# EasyEDA Pro project LY-5X-V3.1 - (0826)留EN.eprj, board 4轴PCB
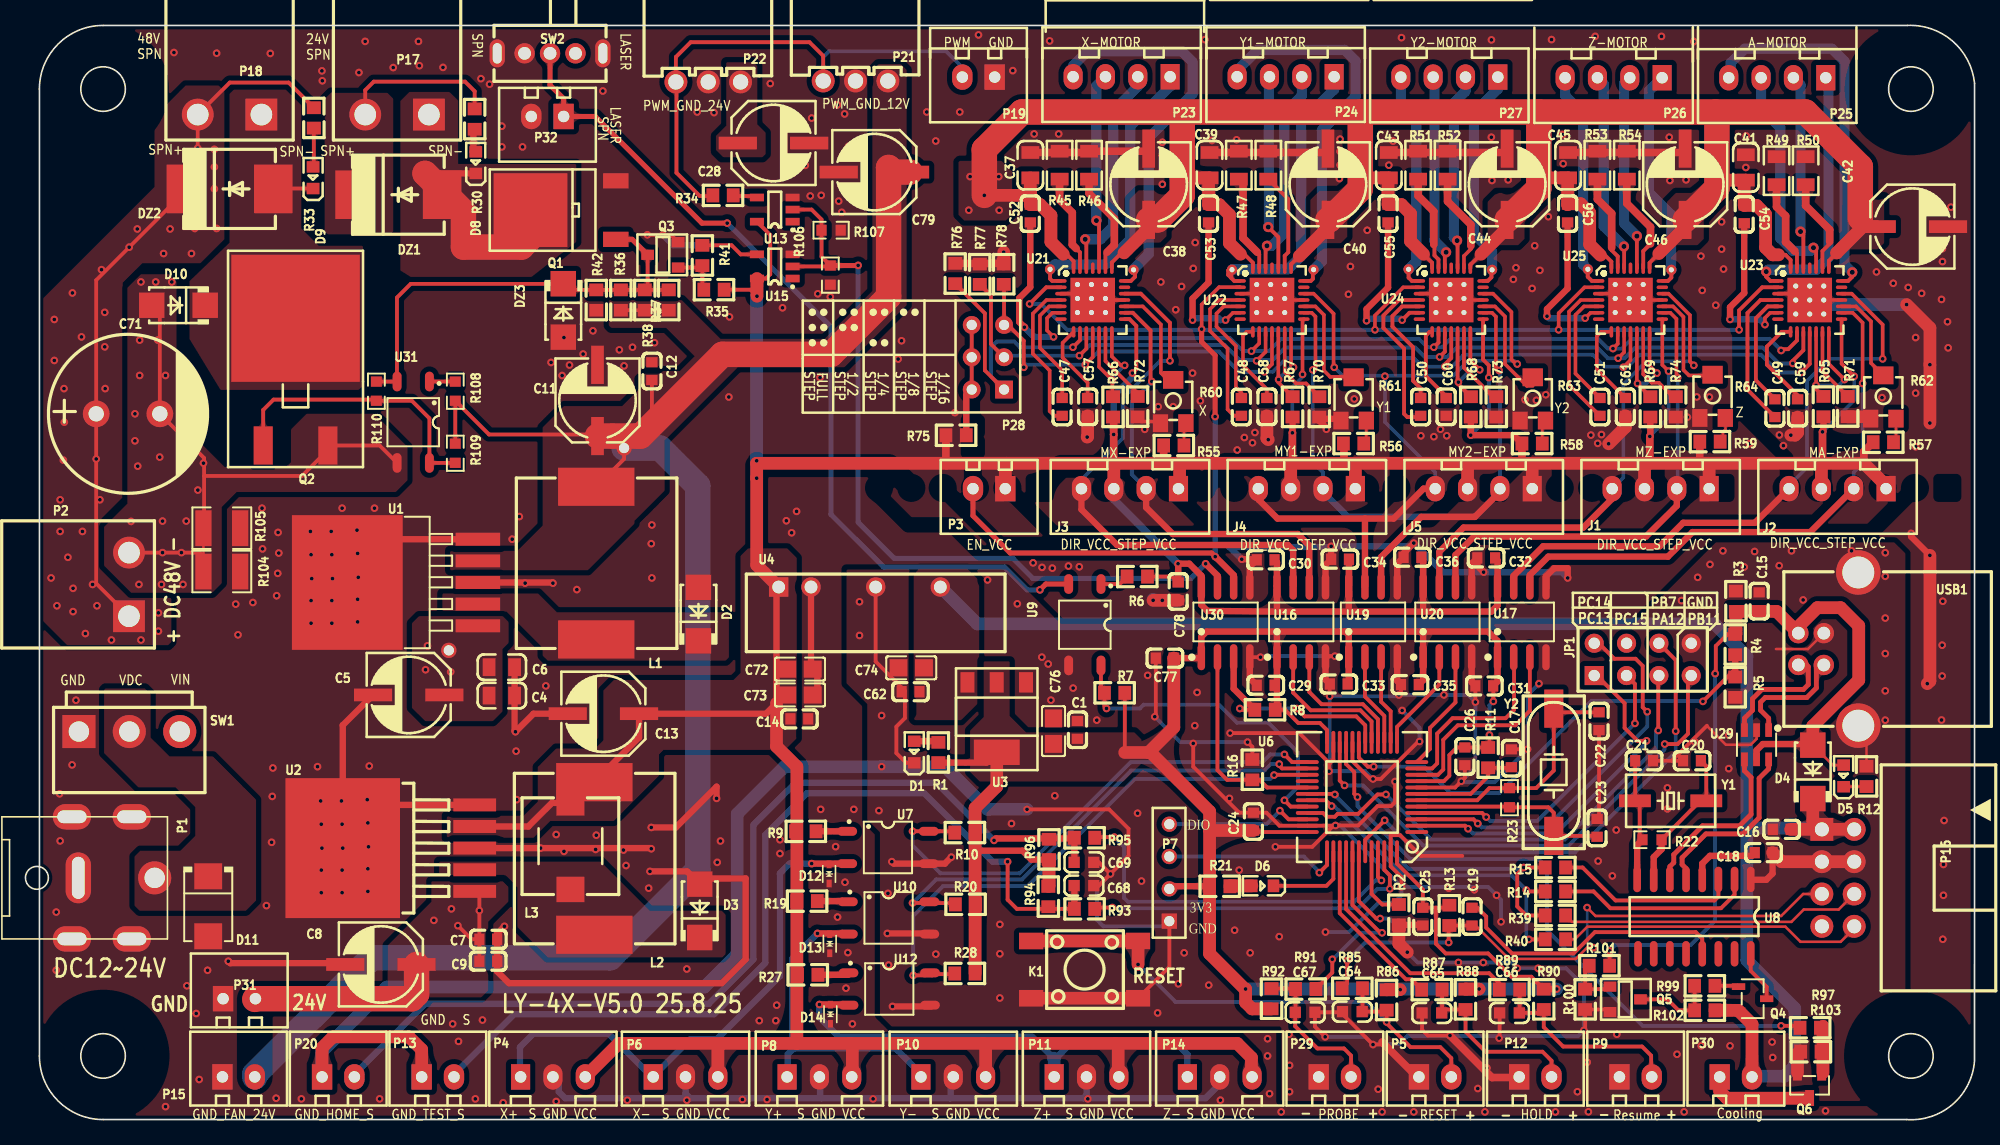
[diagram p1: board, top side]
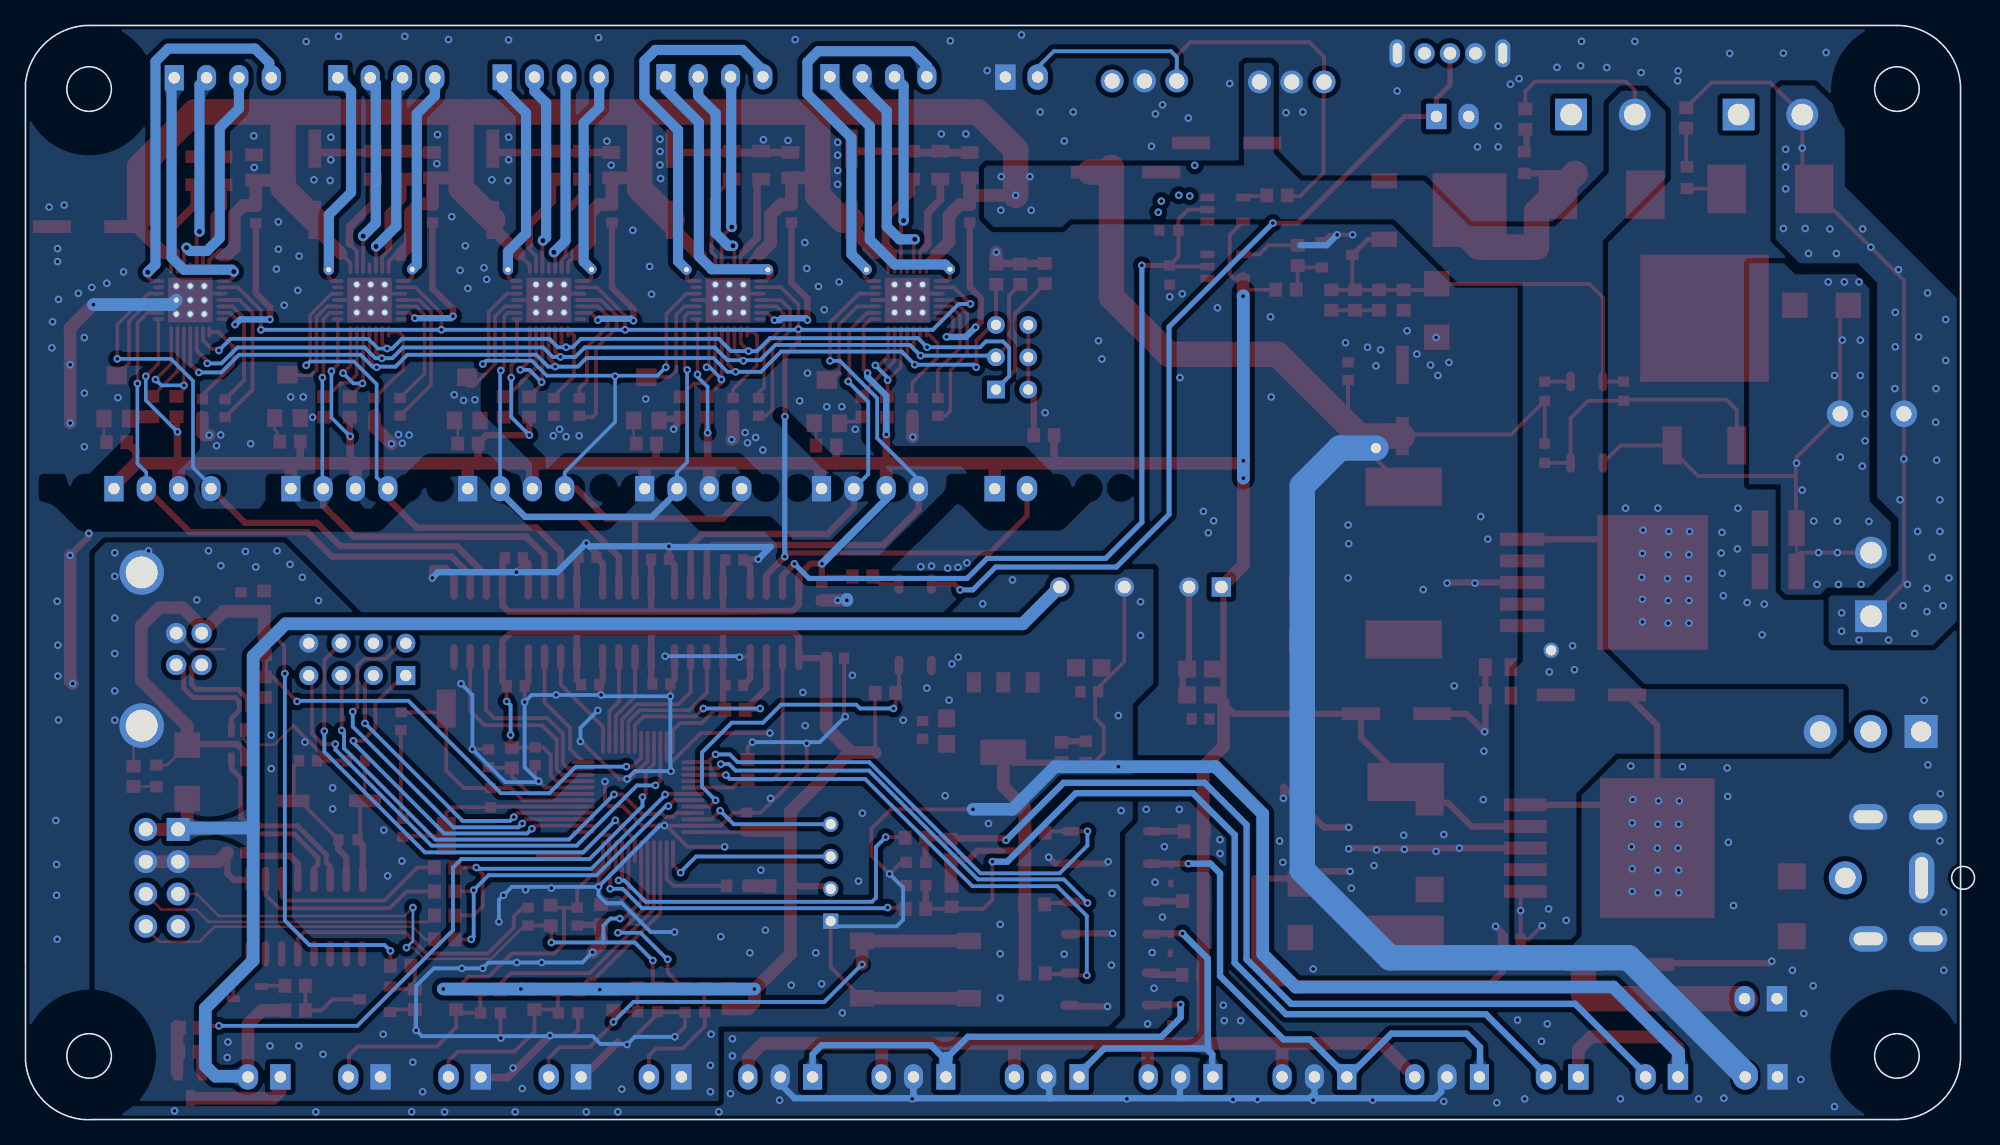
[diagram p2: board, bottom side, seen from below]

Outline 153.09 x 86 mm; copper layers: Top Layer, Bottom Layer. Coordinates in mm from the lower left corner of the outline.
Outline path: circle c6.1,81 r1.75 ; circle c6.1,5 r1.75 ; circle c148.1,81 r1.75 ; circle c148.1,5 r1.75 ; 1.1,81 1.1,5 arc(2.56,1.46) 6.1,0 147.76,0 arc(151.38,1.2) 153.09,4.62 153.09,81.43 arc(151.36,84.77) 147.81,86 6.1,86 arc(2.56,84.54) 1.1,81
Stack: Top Layer 0.0356mm / Dielectric1 0.32mm FR-4 er 4.8 / Bottom Layer 0.0356mm

## Design rules (mm)
net USB_DP: DP
net USB_DM: DP
net USB_DP_1: USB
net USB_DM_1: USB
template: 用户自定义配置
spacing Clearance (default): track to track 0.178, other pairs 0 to 0.3
track width Width (default): min 0.01, default 0.254, max 5.001
differential pair DiffPairsRouting (default): width min 0.381, default 0.381, max 0.381; gap min 0.254, default 0.254
via RoutingVias (default): diameter min 0.5, default 0.6, max 1.27; hole min 0.3, default 0.3, max 1

## Placement (name value [footprint] x y rotation side)
C1  104  [C0603]  82.63 30.63 270 top
C4  105  [0805C]  37.42 33.33 0 top
C5  100uF/35V  [电解电容贴片6x6]  30.1 33.38 180 top
C6  105  [0805C]  37.42 35.56 180 top
C7  105  [C0603]  36.35 12.45 0 top
C8  100uF/35V  [电解电容贴片6x6]  27.92 12.19 180 top
C9  105  [C0603]  36.35 14.17 180 top
C11  100uF/35V  [电解电容贴片6x6]  44.93 56.52 90 top
C12  104  [C0603]  49.2 58.83 270 top
C13  100uF/35V  [电解电容贴片6x6]  45.39 31.9 180 top
C14  104  [C0603]  60.79 31.5 180 top
C15  104  [C0603]  136.17 40.74 270 top
C16  104  [C0603]  137.95 22.81 0 top
C17  104  [C0603]  116.72 28.4 270 top
C18  103  [C0603]  136.53 20.98 0 top
C19  104  [C0603]  113.62 15.95 270 top
C20  18pF  [C0603]  130.9 28.2 180 top
C21  18pF  [C0603]  127.14 28.2 0 top
C22  100pF  [C0603]  123.6 31.31 270 top
C23  100pF  [C0603]  123.45 22.93 90 top
C24  104  [C0603]  96.45 23.42 270 top
C25  104  [C0603]  109.76 15.95 90 top
C26  104  [C0603]  113.06 28.55 90 top
C28  100uF/35V  [电解电容贴片6x6]  58.75 76.76 0 top
C29  100nF  [C0603]  97.41 34.14 180 top
C30  100nF  [C0603]  97.41 43.99 0 top
C31  100nF  [C0603]  114.58 34.09 180 top
C32  100nF  [C0603]  114.74 44.14 0 top
C33  100nF  [C0603]  103.15 34.24 180 top
C34  100nF  [C0603]  103.26 44.04 0 top
C35  100nF  [C0603]  108.74 34.19 180 top
C36  100nF  [C0603]  108.95 44.2 0 top
C37  105  [0805C]  78.93 75.02 90 top
C38  47uF/50V  [电解电容贴片6x6]  88.22 73.52 90 top
C39  105  [0805C]  93.01 75.02 90 top
C40  47uF/50V  [电解电容贴片6x6]  102.3 73.52 90 top
C41  105  [0805C]  135.13 74.84 90 top
C42  47uF/50V  [电解电容贴片6x6]  148.21 70.19 0 top
C43  105  [0805C]  107.09 75.02 90 top
C44  47uF/50V  [电解电容贴片6x6]  116.38 73.52 90 top
C45  105  [0805C]  121.17 75.02 90 top
C46  47uF/50V  [电解电容贴片6x6]  130.36 73.52 90 top
C47  104  [C0603]  81.43 56.02 90 top
C48  104  [C0603]  95.51 56.02 90 top
C49  104  [C0603]  137.42 55.91 90 top
C50  104  [C0603]  109.59 56.02 90 top
C51  104  [C0603]  123.67 56.02 90 top
C52  104  [C0603]  78.93 71.22 90 top
C53  104  [C0603]  92.93 71.22 90 top
C54  104  [C0603]  135 71.15 90 top
C55  104  [C0603]  107.03 71.22 90 top
C56  104  [C0603]  121.13 71.22 90 top
C57  224  [C0603]  83.43 56.02 270 top
C58  224  [C0603]  97.51 56.02 270 top
C59  224  [C0603]  139.19 55.91 270 top
C60  224  [C0603]  111.59 56.02 270 top
C61  224  [C0603]  125.67 56.02 270 top
C62  104  [C0603]  69.52 33.63 0 top
C64  103  [0603C]  104.22 8.48 0 top
C65  103  [0603C]  110.47 8.38 0 top
C66  103  [0603C]  116.57 8.38 0 top
C67  103  [0603C]  100.51 8.43 180 top
C68  103  [0603C]  83.14 18.39 180 top
C69  103  [0603C]  83.14 20.22 180 top
C71  220uF  [CAP-TH_BD12.5-P5.00-D0.6-FD]  8.06 55.47 0 top
C72  4.7uF  [C0805]  60.84 35.41 180 top
C73  4.7uF  [C0805]  60.84 33.38 180 top
C74  4.7uF  [C0805]  69.58 35.51 0 top
C76  10uF  [C0805]  80.75 30.53 90 top
C77  100nF  [C0603]  89.49 36.27 180 top
C78  100nF  [C0603]  90.54 41.52 90 top
C79  100uF/35V  [电解电容贴片6x6]  66.68 74.47 180 top
D1  ---  [0603LED]  69.83 28.85 270 top
D2  SS56  [SMA]  52.86 39.73 90 top
D3  SS56  [SMA]  52.96 16.41 90 top
D4  SS56  [SMA]  140.39 27.33 90 top
D5  ---  [0603LED]  142.83 26.97 270 top
D6  -̹-  [0603LED]  97.21 18.39 0 top
D8  -̹-  [0603LED]  35.39 75.18 270 top
D9  -̹-  [0603LED]  22.61 74 270 top
D10  SS56  [SMA]  12.02 64.01 180 top
D11  SMBJ36A  [SMB_L4.6-W3.6-LS5.3-RD]  14.36 16.76 270 top
D12  ESD05V52D-C  [SOD-523_L1.2-W0.8-LS1.6-BI]  63.12 19.3 90 top
D13  ESD05V52D-C  [SOD-523_L1.2-W0.8-LS1.6-BI]  63.17 13.82 90 top
D14  ESD05V52D-C  [SOD-523_L1.2-W0.8-LS1.6-BI]  63.23 8.28 90 top
DZ1  --ָ-------RS2M  [SMC]  29.29 72.69 0 top
DZ2  --ָ-------RS2M  [SMC]  16.03 73.15 0 top
DZ3  --ѹ------SMAZ10V  [SMA]  42.24 63.6 270 top
J1  4P  [HDR1X4_CON]  132.25 49.59 180 top
J2  4P  [HDR1X4_CON]  146.14 49.59 180 top
J3  4P  [HDR1X4_CON]  90.57 49.59 180 top
J4  4P  [HDR1X4_CON]  104.46 49.59 180 top
J5  4P  [HDR1X4_CON]  118.35 49.59 180 top
JP1  MPJA101-0801A650C1BA  [HDR-TH_8P-P2.54-V-F-R2-C5-S2.54_5-534206-4]  127.03 36.17 0 top
K1  SW_6X6_H=12.0MM  [KEY-SMD_4P-L6.0-W6.0-P4.50-LS9.0]  83.19 11.79 180 top
L1  33uH  [IND-SMD_L13.45-W12.6]  44.84 43.74 90 top
L2  33uH  [IND-SMD_L13.45-W12.6]  44.68 20.52 90 top
L3  33uH  [IND-SMD_L7.0-W7.0_SMDRI74-330MT]  42.8 21.49 90 top
NOREF  -  [Pad_ie3435]  140.15 63.32 270 top
NOREF#2  -  [Pad_ie69]  98.91 65.63 0 top
NOREF#3  -  [Pad_ie86]  87.04 66.79 0 top
NOREF#4  -  [Pad_ie77]  82.63 63.43 180 top
NOREF#5  -  [Pad_ie48]  124.87 65.63 180 top
NOREF#6  -  [Pad_ie83]  82.63 65.63 180 top
NOREF#7  -  [Pad_ie46]  125.97 65.63 0 top
NOREF#8  -  [Pad_ie3445]  140.15 64.42 270 top
NOREF#9  -  [Pad_ie84]  84.83 65.63 0 top
NOREF#10  -  [Pad_ie57]  111.89 65.63 0 top
NOREF#11  -  [Pad_ie42]  47.02 52.78 90 top
NOREF#12  -  [Pad_ie76]  96.71 63.43 180 top
NOREF#13  -  [Pad_ie58]  112.99 65.63 0 top
NOREF#14  -  [Pad_ie63]  111.89 63.43 270 top
NOREF#15  -  [Pad_ie55]  108.64 66.83 0 top
NOREF#16  -  [Pad_ie72]  98.91 64.53 0 top
NOREF#17  -  [Pad_ie88]  33.25 36.88 90 top
NOREF#18  -  [Pad_ie3434]  141.25 63.32 0 top
NOREF#19  -  [Pad_ie49]  125.97 64.53 270 top
NOREF#20  -  [Pad_ie82]  83.73 64.53 270 top
NOREF#21  -  [Pad_ie60]  111.89 64.53 270 top
NOREF#22  -  [Pad_ie47]  127.07 65.63 0 top
NOREF#23  -  [Pad_ie53]  127.07 63.43 0 top
NOREF#24  -  [Pad_ie3422]  140.15 65.52 0 top
NOREF#25  -  [Pad_ie50]  127.07 64.53 0 top
NOREF#26  -  [Pad_ie62]  110.79 64.53 180 top
NOREF#27  -  [Pad_ie45]  129.28 66.79 0 top
NOREF#28  -  [Pad_ie70]  96.71 65.63 180 top
NOREF#29  -  [Pad_ie78]  84.83 63.43 0 top
NOREF#30  -  [Pad_ie3423]  141.25 65.52 0 top
NOREF#31  -  [Pad_ie59]  110.79 65.63 180 top
NOREF#32  -  [Pad_ie79]  83.73 63.43 270 top
NOREF#33  -  [Pad_ie80]  82.63 64.53 180 top
NOREF#34  -  [Pad_ie66]  94.77 66.8 0 top
NOREF#35  -  [Pad_ie74]  97.81 63.43 270 top
NOREF#36  -  [Pad_ie3446]  139.05 64.42 180 top
NOREF#37  -  [Pad_ie51]  124.87 64.53 180 top
NOREF#38  -  [Pad_ie61]  112.99 64.53 0 top
NOREF#39  -  [Pad_ie65]  110.79 63.43 180 top
NOREF#40  -  [Pad_ie85]  83.73 65.63 0 top
NOREF#41  -  [Pad_ie64]  112.99 63.43 0 top
NOREF#42  -  [Pad_ie44]  122.72 66.83 0 top
NOREF#43  -  [Pad_ie67]  101.17 66.8 0 top
NOREF#44  -  [Pad_ie3447]  139.05 63.32 180 top
NOREF#45  -  [Pad_ie75]  98.91 63.43 0 top
NOREF#46  -  [Pad_ie52]  125.97 63.43 270 top
NOREF#47  -  [Pad_ie56]  115.2 66.79 0 top
NOREF#48  -  [Pad_ie3433]  141.25 64.42 0 top
NOREF#49  -  [Pad_ie54]  124.87 63.43 180 top
NOREF#50  -  [Pad_ie3421]  139.05 65.52 180 top
NOREF#51  -  [Pad_ie87]  80.48 66.83 0 top
NOREF#52  -  [Pad_ie81]  84.83 64.53 0 top
NOREF#53  -  [Pad_ie73]  96.71 64.53 180 top
NOREF#54  -  [Pad_ie71]  97.81 64.53 270 top
NOREF#55  -  [Pad_ie68]  97.81 65.63 0 top
P1  -  [DC007B]  -1.85 19 180 top
P2  DB2ER-5.0-2P-GN  [conn-th_2p-p5.00_db2er-5.0-2p-gn]  0.13 42.06 90 top
P3  2P  [HDR1X2_CON]  75.69 49.59 180 top
P4  3P  [HDR1X3_CON]  41.43 3.35 0 top
P5  2P  [HDR1X2_CON]  110.72 3.35 0 top
P6  3P  [HDR1X3_CON]  51.85 3.35 0 top
P7  4P  [SIP4]  89.84 15.6 90 top
P8  3P  [HDR1X3_CON]  62.36 3.35 0 top
P9  2P  [HDR1X2_CON]  126.47 3.35 0 top
P10  3P  [HDR1X3_CON]  72.88 3.35 0 top
P11  3P  [HDR1X3_CON]  83.34 3.35 0 top
P12  2P  [HDR1X2_CON]  118.6 3.35 0 top
P13  2P  [HDR1X2_CON]  32.39 3.35 0 top
P14  3P  [HDR1X3_CON]  93.81 3.35 0 top
P15  2P--ɫ  [HDR1X2_CON]  16.74 3.35 0 top
P16  HC-JN254-2-04-W  [HDR-TH_8P-P2.54-H-F-R2-C4-W9.0]  142.37 19 90 top
P17  2P  [CONN-TH_2P-P5.00_DB2ER-5.0-2P-GN]  29.19 78.99 180 top
P18  DB2ER-5.0-2P-GN  [CONN-TH_2P-P5.00_DB2ER-5.0-2P-GN]  16.03 78.99 180 top
P19  2P  [HDR1X2_CON]  74.86 81.94 180 top
P20  2P  [HDR1X2_CON]  24.57 3.35 0 top
P21  XH-3AW  [conn-th_3p-p2.54_hctl_xh-3aw]  65.14 81.64 0 top
P22  XH-3AW  [conn-th_3p-p2.54_hctl_xh-3aw]  53.57 81.56 0 top
P23  4P  [HDR1X4_CON]  89.91 81.97 180 top
P24  4P  [HDR1X4_CON]  102.79 81.97 180 top
P25  4P  [HDR1X4_CON]  141.41 81.89 180 top
P26  4P  [HDR1X4_CON]  128.55 81.89 180 top
P27  4P  [HDR1X4_CON]  115.65 81.94 180 top
P28  Header 3X2  [HDR2X3]  76.86 57.38 90 top
P29  2P  [HDR1X2_CON]  102.85 3.35 0 top
P30  2P  [HDR1X2_CON]  134.35 3.35 0 top
P31  2P--ɫ  [HDR1X2_CON]  16.79 9.5 0 top
P32  2P  [HDR1X2_CON]  41 78.84 180 top
Q1  F50N06  [TO-252]  43.77 71.49 90 top
Q2  F540NS  [TO-263-2]  21.21 52.98 270 top
Q3  SS8050  [SOT-23]  50.07 67.97 90 top
Q4  SI2301CDS-T1-GE3  [SOT-23-3_L3.0-W1.7-P0.95-LS2.9-BR]  135.67 9.5 180 top
Q5  SS8050  [SOT-23]  125.66 9.45 270 top
Q6  si2302-nmosfet  [SOT-23-3_L2.9-W1.3-P1.90-LS2.4-BR]  140.14 2.69 90 top
R1  1K  [0603R]  71.71 28.85 90 top
R2  10K  [0603R]  107.88 16.1 90 top
R3  1K/NC  [0603R]  134.35 40.74 270 top
R4  1K/NC  [0603R]  134.29 37.34 270 top
R5  1.8K  [0603R]  134.29 33.98 270 top
R6  470R  [0603R]  87.33 42.68 0 top
R7  10K  [0603R]  85.55 33.54 0 top
R8  10K  [0603R]  97.36 32.21 0 top
R9  470R  [0603R]  61.29 22.66 180 top
R10  10K  [0603R]  73.79 22.56 0 top
R11  10K  [0603R]  114.89 28.45 270 top
R12  1K  [0603R]  144.61 26.97 270 top
R13  10K  [0603R]  111.84 16.05 270 top
R14  1K  [0603R]  120.17 17.93 180 top
R15  10Ω  [0603R]  120.17 19.81 180 top
R16  10K  [0603R]  96.37 27.5 270 top
R19  470R  [0603R]  61.4 17.17 180 top
R20  10K  [0603R]  73.84 16.92 0 top
R21  1K  [0603R]  93.81 18.34 180 top
R22  1M  [R0603]  127.76 22 0 top
R23  1M  [R0603]  116.57 25.3 90 top
R27  470R  [0603R]  61.45 11.38 180 top
R28  10K  [0603R]  73.79 11.48 0 top
R30  10K  [0603R]  35.29 78.64 270 top
R33  10K  [0603R]  22.65 78.73 270 top
R34  100  [0603R]  54.79 72.64 180 top
R35  10K  [0603R]  54.08 65.23 0 top
R36  1K  [0603R]  46.77 64.41 270 top
R37  1K  [0603R]  50.53 64.41 270 top
R38  1K  [0603R]  48.65 64.41 270 top
R39  100  [0603R]  120.17 16.04 0 top
R40  100  [0603R]  120.17 14.16 0 top
R41  100  [0603R]  53.17 67.92 270 top
R42  10K  [0603R]  44.84 64.41 270 top
R45  0.1  [0805R]  81.23 75.02 90 top
R46  0.1  [0805R]  83.54 75.02 270 top
R47  0.1  [0805R]  95.31 75.02 90 top
R48  0.1  [0805R]  97.62 75.02 270 top
R49  0.1  [0805R]  137.54 74.58 90 top
R50  0.1  [0805R]  139.83 74.58 270 top
R51  0.1  [0805R]  109.39 75.02 90 top
R52  0.1  [0805R]  111.7 75.02 270 top
R53  0.1  [0805R]  123.47 75.02 90 top
R54  0.1  [0805R]  125.78 75.02 270 top
R55  20K  [0603R]  90.2 52.98 180 top
R56  20K  [0603R]  104.32 53.14 180 top
R57  20K  [0603R]  145.93 53.24 180 top
R58  20K  [0603R]  118.34 53.14 180 top
R59  20K  [0603R]  132.31 53.29 180 top
R60  10K  [松下贴片电位器3x3]  90.15 56.49 0 top
R61  10K  [松下贴片电位器3x3]  104.32 56.69 0 top
R62  10K  [松下贴片电位器3x3]  145.93 56.84 0 top
R63  10K  [松下贴片电位器3x3]  118.39 56.69 0 top
R64  10K  [松下贴片电位器3x3]  132.52 56.9 0 top
R65  10K  [0603R]  141.23 56.04 90 top
R66  10K  [0603R]  85.43 56.02 90 top
R67  10K  [0603R]  99.53 56.02 90 top
R68  10K  [0603R]  113.53 56.02 90 top
R69  10K  [0603R]  127.63 56.02 90 top
R70  0  [0603R]  101.63 56.02 90 top
R71  0  [0603R]  143.13 56.04 90 top
R72  0  [0603R]  87.36 56.03 90 top
R73  0  [0603R]  115.53 56.02 90 top
R74  0  [0603R]  129.63 56.02 90 top
R75  100  [0603R]  73.1 53.79 0 top
R76  10K  [0603R]  73.03 66.5 90 top
R77  10K  [0603R]  74.96 66.45 90 top
R78  10K  [0603R]  76.84 66.45 90 top
R85  100  [0603R]  104.22 10.31 0 top
R86  10K  [0603R]  106.91 9.4 90 top
R87  100  [0603R]  110.47 10.21 0 top
R88  10K  [0603R]  113.11 9.45 90 top
R89  100  [0603R]  116.57 10.21 0 top
R90  10K  [0603R]  119.26 9.45 90 top
R91  100  [0603R]  100.56 10.26 180 top
R92  10K  [0603R]  97.87 9.5 270 top
R93  100  [0603R]  83.19 16.56 180 top
R94  10K  [0603R]  80.34 17.53 90 top
R95  100  [0603R]  83.19 22.15 180 top
R96  10K  [0603R]  80.4 21.23 270 top
R97  100  [0603R]  140.19 7.21 0 top
R99  1K  [0603R]  131.91 10.52 180 top
R100  10K  [0603R]  122.51 9.45 270 top
R101  1K  [0603R]  123.63 12.09 0 top
R102  10K  [0603R]  131.91 8.59 0 top
R103  10K  [0603R]  140.24 5.33 180 top
R104  0R  [R1210]  15.42 43.08 180 top
R105  0R  [R1210]  15.42 46.48 180 top
R106  10K  [R0603]  63.22 66.38 90 top
R107  10K  [R0603]  63.28 69.91 180 top
R108  1K  [R0603]  33.76 57.25 270 top
R109  10K  [R0603]  33.76 52.38 90 top
R110  0R  [R0603]  27.56 57.25 270 top
SW1  ZX-VH3.96-3PZZ  [CONN-TH_3P-P3.96_MEGASTAR_ZX-VH3.96-3PZZ]  8.16 30.5 0 top
SW2  SK12D07VG4  [SW-TH_SHOU_SK12D07VG5]  41.2 83.81 180 top
U1  HYM2596S-12  [TO-263-5_L10.2-W8.6-P1.70-LS14.4-BR]  30.41 42.22 0 top
U2  LM2596S-5.0RG  [TO-263-5_L10.1-W8.7-P1.70-LS15.2-BR]  30.1 21.34 0 top
U3  1117-3.3  [SOT-223]  76.29 31.67 180 top
U4  B0505LS-1WR3  [PWRM-TH_BXXXXLS-1WR3]  65.51 41.86 0 top
U6  STM32F103C8T6/CBT6  [LQFP48]  104.98 25.35 180 top
U7  LTV-357T-C  [SOP-4_L4.4-W3.9-P2.54-LS7.0-TL]  67.75 21.39 0 top
U8  CH340G  [SOP16]  131.7 15.95 270 top
U9  LTV-357T-C  [SOP-4_L4.4-W3.9-P2.54-LS7.0-TL]  83.21 38.89 270 top
U10  LTV-357T-C  [SOP-4_L4.4-W3.9-P2.54-LS7.0-TL]  67.8 15.85 0 top
U12  LTV-357T-C  [SOP-4_L4.4-W3.9-P2.54-LS7.0-TL]  67.85 10.26 0 top
U13  74LVC1G17  [SOT-23-5]  58.86 71.53 180 top
U15  74LVC1G04  [SOT-23-5]  58.86 67.06 180 top
U16  CA-IS3720LS  [SOIC-8_L4.9-W3.9-P1.27-LS6.0-BL]  100.21 39.12 0 top
U17  CA-IS3720LS  [SOIC-8_L4.9-W3.9-P1.27-LS6.0-BL]  117.53 39.12 0 top
U19  CA-IS3720LS  [SOIC-8_L4.9-W3.9-P1.27-LS6.0-BL]  105.85 39.12 0 top
U20  CA-IS3720LS  [SOIC-8_L4.9-W3.9-P1.27-LS6.0-BL]  111.69 39.12 0 top
U21  HR4988SQ  [QFN28]  84.08 64.32 270 top
U22  HR4988SQ  [QFN28]  98.17 64.32 270 top
U23  HR4988SQ  [QFN28]  140.4 64.32 270 top
U24  HR4988SQ  [QFN28]  112.25 64.32 270 top
U25  HR4988SQ  [QFN28]  126.33 64.32 270 top
U29  MSUSBLC6-2SC6  [SOT-23-6_L2.9-W1.6-P0.95-LS2.8-BL]  135.97 29.46 180 top
U30  CA-IS3720LS  [SOIC-8_L4.9-W3.9-P1.27-LS6.0-BL]  94.26 39.12 0 top
U31  LTV-357T-C  [SOP-4_L4.4-W3.9-P2.54-LS7.0-TL]  30.46 54.81 270 top
USB1  USB-B10-BRW  [USB-B-TH_USB-B10-BRW]  141.61 36.98 90 top
Y1  12M  [晶振贴片49SSMD]  129.22 25.05 0 top
Y2  8M  [晶振贴片]  120.04 27.3 90 top

## Footprints (pads in the part's own frame, mm; a bottom-side part is the same pattern mirrored in y, then rotated)
0603C
  rect 0.889x0.889 smd: 1(-0.774,0) 2(0.774,0)
0603LED
  rect 0.9x1 smd: 1(-0.884,-0.017) 2(0.816,-0.017)
0603R
  rect 1x1.1 smd: 1(-0.8,0) 2(0.8,0)
0805C
  rect 1x1.4 smd: 1(-1,0) 2(1,0)
0805R
  rect 1x1.4 smd: 1(-1.1,0) 2(1.1,0)
C0603
  rect 0.8x0.9 smd: 1(-0.7,0) 2(0.7,0)
C0805
  rect 1.41x1.35 smd: 1(-1,0) 2(1,0)
CAP-TH_BD12.5-P5.00-D0.6-FD
  round 2.1 hole 1.2: 1(-2.5,0) 2(2.5,0)
conn-th_2p-p5.00_db2er-5.0-2p-gn
  rect 2.5x2.5 hole 1.7: 1(-2.5,-8)
  round 2.5 hole 1.7: 2(2.5,-8)
CONN-TH_2P-P5.00_DB2ER-5.0-2P-GN
  rect 2.5x2.5 hole 1.7: 1(-2.5,0)
  round 2.5 hole 1.7: 2(2.5,0)
conn-th_3p-p2.54_hctl_xh-3aw
  round 1.8 hole 1.199: 1(2.601,0) 2(0.059,0) 3(-2.479,0)
CONN-TH_3P-P3.96_MEGASTAR_ZX-VH3.96-3PZZ
  rect 2.6x2.6 hole 1.6: 1(-3.96,0)
  round 2.6 hole 1.6: 2(0,0) 3(3.96,0)
DC007B
  round 2.6 hole 1.6: 1(-12,0)
  oval 2x4 hole 1x3.3: 2(-6,0)
  oval 3x2 hole 2.3x1: 3(-5.5,4.8) 4(-10.2,4.8) 5(-5.5,-4.8) 6(-10.2,-4.8)
HDR1X2_CON
  rect 1.6x2 hole 0.9: 1(-1.27,0)
  oval 1.6x2 hole 0.9: 2(1.27,0)
HDR1X3_CON
  rect 1.5x2 hole 0.9: 1(-2.54,0)
  oval 1.5x2 hole 0.9: 2(0,0) 3(2.54,0)
HDR1X4_CON
  rect 1.5x2 hole 0.9: 1(0,0)
  oval 1.5x2 hole 0.9: 2(2.54,0) 3(5.08,0) 4(7.62,0)
HDR2X3
  rect 1.4x1.4 hole 0.8: 1(0,0)
  round 1.4 hole 0.8: 2(0,2.54) 3(2.54,0) 4(2.54,2.54) 5(5.08,0) 6(5.08,2.54)
HDR-TH_8P-P2.54-H-F-R2-C4-W9.0
  rect 1.8x1.8 hole 1.1: 1(3.81,1.27)
  round 1.8 hole 1.1: 2(3.81,-1.27) 3(1.27,1.27) 4(1.27,-1.27) 5(-1.27,1.27) 6(-1.27,-1.27) 7(-3.81,1.27) 8(-3.81,-1.27)
HDR-TH_8P-P2.54-V-F-R2-C5-S2.54_5-534206-4
  rect 1.5x1.5 hole 0.89: 1(-3.81,-1.27)
  round 1.5 hole 0.89: 2(-3.81,1.27) 3(-1.27,-1.27) 4(-1.27,1.27) 5(1.27,-1.27) 6(1.27,1.27) 7(3.81,-1.27) 8(3.81,1.27)
IND-SMD_L7.0-W7.0_SMDRI74-330MT
  rect 2x2.2 smd: 1(-3.4,0) 2(3.4,0)
IND-SMD_L13.45-W12.6
  rect 3x6 smd: 1(-6,0) 2(6,0)
KEY-SMD_4P-L6.0-W6.0-P4.50-LS9.0
  rect 1.9x1.3 smd: 1(-4.2,2.25) 2(4.2,2.25) 3(-4.2,-2.25) 4(4.2,-2.25)
LQFP48
  oval 1.8x0.3 smd: 1(-4.3,2.75) 2(-4.3,2.25) 3(-4.3,1.75) 4(-4.3,1.25) 5(-4.3,0.75) 6(-4.3,0.25) 7(-4.3,-0.25) 8(-4.3,-0.75) 9(-4.3,-1.25) 10(-4.3,-1.75) 11(-4.3,-2.25) 12(-4.3,-2.75) 25(4.3,-2.75) 26(4.3,-2.25) 27(4.3,-1.75) 28(4.3,-1.25) 29(4.3,-0.75) 30(4.3,-0.25) 31(4.3,0.25) 32(4.3,0.75) 33(4.3,1.25) 34(4.3,1.75) 35(4.3,2.25) 36(4.3,2.75)
  oval 0.3x1.8 smd: 13(-2.75,-4.3) 14(-2.25,-4.3) 15(-1.75,-4.3) 16(-1.25,-4.3) 17(-0.75,-4.3) 18(-0.25,-4.3) 19(0.25,-4.3) 20(0.75,-4.3) 21(1.25,-4.3) 22(1.75,-4.3) 23(2.25,-4.3) 24(2.75,-4.3) 37(2.75,4.3) 38(2.25,4.3) 39(1.75,4.3) 40(1.25,4.3) 41(0.75,4.3) 42(0.25,4.3) 43(-0.25,4.3) 44(-0.75,4.3) 45(-1.25,4.3) 46(-1.75,4.3) 47(-2.25,4.3) 48(-2.75,4.3)
Pad_ie42
  round 1.2 hole 0.8: 1(0,0)
Pad_ie44
  round 0.8 hole 0.4: 0(0,0)
Pad_ie45
  round 0.8 hole 0.4: 3(0,0)
Pad_ie46
  round 0.6 hole 0.4: 4(0,0)
Pad_ie47
  round 0.6 hole 0.4: 5(0,0)
Pad_ie48
  round 0.6 hole 0.4: 5(0,0)
Pad_ie49
  round 0.6 hole 0.4: 5(0,0)
Pad_ie50
  round 0.6 hole 0.4: 5(0,0)
Pad_ie51
  round 0.6 hole 0.4: 5(0,0)
Pad_ie52
  round 0.6 hole 0.4: 5(0,0)
Pad_ie53
  round 0.6 hole 0.4: 5(0,0)
Pad_ie54
  round 0.6 hole 0.4: 5(0,0)
Pad_ie55
  round 0.8 hole 0.4: 0(0,0)
Pad_ie56
  round 0.8 hole 0.4: 3(0,0)
Pad_ie57
  round 0.6 hole 0.4: 4(0,0)
Pad_ie58
  round 0.6 hole 0.4: 5(0,0)
Pad_ie59
  round 0.6 hole 0.4: 5(0,0)
Pad_ie60
  round 0.6 hole 0.4: 5(0,0)
Pad_ie61
  round 0.6 hole 0.4: 5(0,0)
Pad_ie62
  round 0.6 hole 0.4: 5(0,0)
Pad_ie63
  round 0.6 hole 0.4: 5(0,0)
Pad_ie64
  round 0.6 hole 0.4: 5(0,0)
Pad_ie65
  round 0.6 hole 0.4: 5(0,0)
Pad_ie66
  round 0.8 hole 0.4: 0(0,0)
Pad_ie67
  round 0.8 hole 0.4: 3(0,0)
Pad_ie68
  round 0.6 hole 0.4: 4(0,0)
Pad_ie69
  round 0.6 hole 0.4: 5(0,0)
Pad_ie70
  round 0.6 hole 0.4: 5(0,0)
Pad_ie71
  round 0.6 hole 0.4: 5(0,0)
Pad_ie72
  round 0.6 hole 0.4: 5(0,0)
Pad_ie73
  round 0.6 hole 0.4: 5(0,0)
Pad_ie74
  round 0.6 hole 0.4: 5(0,0)
Pad_ie75
  round 0.6 hole 0.4: 5(0,0)
Pad_ie76
  round 0.6 hole 0.4: 5(0,0)
Pad_ie77
  round 0.6 hole 0.4: 5(0,0)
Pad_ie78
  round 0.6 hole 0.4: 5(0,0)
Pad_ie79
  round 0.6 hole 0.4: 5(0,0)
Pad_ie80
  round 0.6 hole 0.4: 5(0,0)
Pad_ie81
  round 0.6 hole 0.4: 5(0,0)
Pad_ie82
  round 0.6 hole 0.4: 5(0,0)
Pad_ie83
  round 0.6 hole 0.4: 5(0,0)
Pad_ie84
  round 0.6 hole 0.4: 5(0,0)
Pad_ie85
  round 0.6 hole 0.4: 4(0,0)
Pad_ie86
  round 0.8 hole 0.4: 3(0,0)
Pad_ie87
  round 0.8 hole 0.4: 0(0,0)
Pad_ie88
  round 1.2 hole 0.8: 1(0,0)
Pad_ie3421
  round 0.6 hole 0.4: 5(0,0)
Pad_ie3422
  round 0.6 hole 0.4: 4(0,0)
Pad_ie3423
  round 0.6 hole 0.4: 5(0,0)
Pad_ie3433
  round 0.6 hole 0.4: 5(0,0)
Pad_ie3434
  round 0.6 hole 0.4: 5(0,0)
Pad_ie3435
  round 0.6 hole 0.4: 5(0,0)
Pad_ie3445
  round 0.6 hole 0.4: 5(0,0)
Pad_ie3446
  round 0.6 hole 0.4: 5(0,0)
Pad_ie3447
  round 0.6 hole 0.4: 5(0,0)
PWRM-TH_BXXXXLS-1WR3
  rect 1.524x1.524 hole 1: 1(-6.35,0)
  round 1.524 hole 1: 2(-3.81,0) 4(1.27,0) 6(6.35,0)
QFN28
  oval 0.28x0.895 smd: 1(-1.601,-2.756) 2(-1.101,-2.756) 3(-0.601,-2.756) 4(-0.101,-2.756) 5(0.4,-2.756) 6(0.9,-2.756) 7(1.401,-2.756) 15(1.401,2.244) 16(0.9,2.244) 17(0.4,2.244) 18(-0.101,2.244) 19(-0.601,2.244) 20(-1.101,2.244) 21(-1.601,2.244)
  oval 0.895x0.28 smd: 8(2.4,-1.758) 9(2.4,-1.257) 10(2.4,-0.756) 11(2.4,-0.257) 12(2.4,0.244) 13(2.4,0.745) 14(2.4,1.245) 22(-2.6,1.245) 23(-2.6,0.745) 24(-2.6,0.244) 25(-2.6,-0.257) 26(-2.6,-0.756) 27(-2.6,-1.257) 28(-2.6,-1.758)
  rect 3.5x3.5 smd: 29(-0.1,-0.256)
R0603
  rect 0.806x0.864 smd: 1(-0.753,0) 2(0.753,0)
R1210
  rect 1.282x2.808 smd: 1(-1.441,0) 2(1.441,0)
SIP4
  rect 1.2x1.2 hole 0.8: 1(0,0)
  round 1.2 hole 0.8: 2(2.54,0) 3(5.08,0) 4(7.62,0)
SMA
  rect 2x2 smd: 1(2.1,0) 2(-2.1,0)
SMB_L4.6-W3.6-LS5.3-RD
  rect 2.047x2.192 smd: 1(-2.361,0) 2(2.361,0)
SMC
  rect 3.03x3.82 smd: 1(3.435,0) 2(-3.435,0)
SOD-523_L1.2-W0.8-LS1.6-BI
  rect 0.6x0.4 smd: 1(-0.75,0) 2(0.75,0)
SOIC-8_L4.9-W3.9-P1.27-LS6.0-BL
  oval 0.588x2.045 smd: 1(-1.905,-2.772) 2(-0.635,-2.772) 3(0.635,-2.772) 4(1.905,-2.772) 5(1.905,2.772) 6(0.635,2.772) 7(-0.635,2.772) 8(-1.905,2.772)
SOP16
  oval 2x0.6 smd: 1(-2.921,3.81) 2(-2.921,2.54) 3(-2.921,1.27) 4(-2.921,0) 5(-2.921,-1.27) 6(-2.921,-2.54) 7(-2.921,-3.81) 8(-2.921,-5.11) 9(2.921,-5.04) 10(2.921,-3.81) 11(2.921,-2.54) 12(2.921,-1.27) 13(2.921,0) 14(2.921,1.27) 15(2.921,2.54) 16(2.921,3.81)
SOP-4_L4.4-W3.9-P2.54-LS7.0-TL
  oval 1.55x0.7 smd: 1(-3.2,1.27) 2(-3.2,-1.27) 3(3.2,-1.27) 4(3.2,1.27)
SOT-23
  rect 0.8x1 smd: 1(-1,-1.2) 2(0,1.2) 3(1,-1.2)
SOT-23-3_L2.9-W1.3-P1.90-LS2.4-BR
  rect 1.25x0.7 smd: 1(1,-0.95) 2(1,0.95) 3(-1,0)
SOT-23-3_L3.0-W1.7-P0.95-LS2.9-BR
  rect 1.038x0.532 smd: 1(1.101,-0.95) 2(1.101,0.95) 3(-1.101,0)
SOT-23-5
  rect 1.1x0.6 smd: 1(-1.4,0.95) 2(-1.4,0) 3(-1.4,-0.95) 4(1.4,-0.95) 5(1.4,0.95)
SOT-23-6_L2.9-W1.6-P0.95-LS2.8-BL
  rect 0.532x1.072 smd: 1(-0.95,-1.149) 2(0,-1.149) 3(0.95,-1.149) 4(0.95,1.149) 5(0,1.149) 6(-0.95,1.149)
SOT-223
  rect 1.1x1.6 smd: 1(-2.3,-2.7) 2(0,-2.7) 3(2.3,-2.7)
  rect 3.6x2 smd: 4(0,2.8)
SW-TH_SHOU_SK12D07VG5
  oval 1.6x1.6 hole 1: 1(-2,0) 2(0,0) 3(2,0)
  oval 1.2x2.2 hole 0.7x1.6: 4(4.15,0) 5(-4.15,0)
TO-252
  rect 1.2x2 smd: 1(-2.3,-2.6) 3(2.3,-2.6)
  rect 5.8x5.8 smd: 2(0,4.1)
TO-263-2
  rect 3x1.5 smd: 1(0,-2.54) 3(0,2.54)
  rect 10x10.1 smd: 2(-10,0)
TO-263-5_L10.1-W8.7-P1.70-LS15.2-BR
  rect 3.358x1.02 smd: 1(5.183,-3.4) 2(5.183,-1.7) 3(5.183,0) 4(5.183,1.7) 5(5.183,3.4)
  rect 9x11 smd: 6(-5.184,0)
TO-263-5_L10.2-W8.6-P1.70-LS14.4-BR
  rect 3.5x1.02 smd: 1(5.127,-3.4) 2(5.127,-1.7) 3(5.127,0) 4(5.127,1.7) 5(5.127,3.4)
  rect 8.705x10.587 smd: 6(-5.127,0)
USB-B-TH_USB-B10-BRW
  round 1.6 hole 1: 1(1.25,2.355) 2(-1.25,2.355) 3(-1.25,0.355) 4(1.25,0.355)
  round 3.5 hole 2.5: 5(-6.02,-2.355) 6(6.02,-2.355)
晶振贴片
  rect 3x1.5 smd: 1(-5,0) 2(5,0)
晶振贴片49SSMD
  rect 2.5x1 smd: 1(-2.8,0) 2(2.8,0)
松下贴片电位器3x3
  rect 1.2x1.4 smd: 1(-1,-1.75) 3(1,-1.75)
  rect 1.6x1.4 smd: 2(0,1.65)
电解电容贴片6x6
  rect 3x1 smd: 1(-2.8,0) 2(2.8,0)

## Nets
As in the schematic, except:
3V3: C1.2 C24.2 C25.2 C26.2 C29.1 C31.1 C33.1 C35.1 C76.1 C77.1 P7.2 R1.1 R7.2 R8.2 R10.2 R11.1 R13.1 R20.2 R21.2 R28.2 R86.2 R88.2 R90.2 R92.2 R94.2 R96.2 U3.2 U3.4 U6.9 U6.24 U6.36 U6.48 U16.1 U17.1 U19.1 U20.1 U30.1
12V: C11.1 C12.2 C79.1 L1.2 NOREF#11.1 P15.2 P21.1 R36.2 R37.2 R38.2 R108.2 R109.2 U1.4
24V: C4.1 C5.1 C6.2 C7.1 C8.1 C9.2 C28.1 C37.1 C38.1 C39.1 C40.1 C41.1 C42.1 C43.1 C44.1 C45.1 C46.1 C52.2 C53.2 C54.2 C55.2 C56.2 DZ1.2 NOREF#17.1 P17.2 P22.1 P31.2 R30.1 SW1.3 U1.1 U2.1 U21.22 U21.28 U22.22 U22.28 U23.22 U23.28 U24.22 U24.28 U25.22 U25.28
GND: C4.2 C5.2 C6.1 C7.2 C8.2 C9.1 C11.2 C12.1 C13.2 C14.1 C28.2 C30.1 C32.1 C34.1 C36.1 C37.2 C38.2 C39.2 C40.2 C41.2 C42.2 C43.2 C44.2 C45.2 C46.2 C57.2 C58.2 C59.2 C60.2 C61.2 C72.1 C73.1 C78.1 C79.2 D2.1 D3.1 D11.2 D12.1 D13.1 D14.1 DZ3.1 NOREF.5 NOREF#2.5 NOREF#4.5 NOREF#5.5 NOREF#6.5 NOREF#7.4 NOREF#8.5 NOREF#9.5 NOREF#10.4 NOREF#12.5 NOREF#13.5 NOREF#14.5 NOREF#16.5 NOREF#18.5 NOREF#19.5 NOREF#20.5 NOREF#21.5 NOREF#22.5 NOREF#23.5 NOREF#24.4 NOREF#25.5 NOREF#26.5 NOREF#28.5 NOREF#29.5 NOREF#30.5 NOREF#31.5 NOREF#32.5 NOREF#33.5 NOREF#35.5 NOREF#36.5 NOREF#37.5 NOREF#38.5 NOREF#39.5 NOREF#40.4 NOREF#41.5 NOREF#44.5 NOREF#45.5 NOREF#46.5 NOREF#48.5 NOREF#49.5 NOREF#50.5 NOREF#52.5 NOREF#53.5 NOREF#54.5 NOREF#55.4 P1.2 P1.3 P1.4 P1.5 P1.6 P4.2 P6.2 P8.2 P10.2 P11.2 P14.2 P15.1 P19.1 P21.2 P22.2 P31.1 P32.2 Q1.3 Q3.3 R42.2 R45.2 R46.1 R47.2 R48.1 R49.2 R50.1 R51.2 R52.1 R53.2 R54.1 R60.1 R61.1 R62.1 R63.1 R64.1 R70.1 R71.1 R72.1 R73.1 R74.1 R76.2 R77.2 R78.2 R104.1 R105.1 R106.1 R107.1 SW1.1 SW2.3 SW2.4 SW2.5 U1.3 U1.5 U1.6 U2.3 U2.5 U2.6 U4.2 U13.3 U15.3 U16.5 U17.5 U19.5 U20.5 U21.3 U21.18 U21.29 U22.3 U22.18 U22.29 U23.3 U23.18 U23.29 U24.3 U24.18 U24.29 U25.3 U25.18 U25.29 U30.5
PGND: C1.1 C15.1 C16.1 C17.1 C18.2 C20.2 C21.2 C22.2 C23.2 C24.1 C25.1 C26.1 C29.2 C31.2 C33.2 C35.2 C62.1 C64.1 C65.1 C66.1 C67.1 C68.1 C69.1 C74.1 C76.2 C77.2 D1.2 JP1.8 K1.1 K1.2 P5.1 P7.1 P9.1 P12.1 P13.1 P16.3 P16.4 P20.1 P29.1 Q5.3 Q6.2 R2.1 R3.1 R5.2 R12.1 R16.1 R100.2 R103.2 U3.1 U4.4 U6.8 U6.20 U6.23 U6.35 U6.47 U7.3 U8.1 U9.3 U10.3 U12.3 U16.4 U17.4 U19.4 U20.4 U29.2 U30.4 USB1.4 USB1.5 USB1.6
VCC: C13.1 C14.2 C30.2 C32.2 C34.2 C36.2 C72.2 C73.2 C78.2 J1.1 J1.3 J2.1 J2.3 J3.1 J3.3 J4.1 J4.3 J5.1 J5.3 L2.2 L3.2 P3.1 P4.3 P6.3 P8.3 P10.3 P11.3 P14.3 R6.2 R9.2 R19.2 R27.2 R35.2 R55.2 R56.2 R57.2 R58.2 R59.2 R65.1 R66.1 R67.1 R68.1 R69.1 R75.1 U2.4 U4.1 U13.5 U15.5 U16.8 U17.8 U19.8 U20.8 U21.15 U22.15 U23.15 U24.15 U25.15 U30.8
MOTOR_EN: P3.2 U21.2 U22.2 U23.2 U24.2 U25.2 U30.6
MX_1B: NOREF#3.3 P23.4 U21.21
MX_2B: NOREF#51.0 P23.1 U21.1
MY1_1B: NOREF#43.3 P24.4 U22.21
MY1_2B: NOREF#34.0 P24.1 U22.1
MY2_1B: NOREF#47.3 P27.1 U24.21
MY2_2B: NOREF#15.0 P27.4 U24.1
MZ_1B: NOREF#27.3 P26.1 U25.21
MZ_2B: NOREF#42.0 P26.4 U25.1
PA11: R7.1 U6.32 U9.4
SPINDLE_PWM: R106.2 R107.2 U13.2 U15.2 U30.7
SW_CNC: P32.1 SW2.2 U9.2
$1N27339: R6.1 U9.1

Pads without a net: JP1 4; P16 7; SW2 1; U6 1; U8 9 10 11 12 14 15; U13 1; U15 1; U21 7 20 25; U22 7 20 25; U23 7 20 25; U24 7 20 25; U25 7 20 25

## Via types
v1: diameter 0.6, hole 0.3, Top Layer to Bottom Layer, 629 vias
v2: diameter 0.8, hole 0.4, Top Layer to Bottom Layer, 12 vias

## Routing (per net, layer and track width the routed paths; a pad name or vN(x,y) marks a point on that pad's centre or on a via; arc(x,y) is an arc through that point)
3V3: length 194.2
  Top Layer w0.3: 111.64,16.85 111.44,16.65 110.79,16.65 ; U6.24 102.23,30.61 101.67,31.17 99.97,31.17 98.94,32.21 R8.2 ; 115.28,34.09 115.3,34.08 v1(115.3,32.87) ; U6.36 96.57,22.6 C24.2 ; 110.79,16.65 110.79,13.82 111.55,13.06 114.89,13.06 116.72,11.23 118.28,11.23 119.26,10.25 ; 110.79,16.65 109.76,16.65 109.76,18.09 107.73,20.11 U6.48 ; v1(114.99,30.23) 114.99,29.35 R11.1 112.44,29.25 111.84,28.65 111.84,27.03 111.41,26.6 U6.9 ; R7.2 86.35,28.86 86.34,28.85
  Top Layer w0.5: 109.56,38.35 114.89,38.35 115.63,37.62 U17.1 115.63,34.43 115.28,34.09 ; 109.56,38.35 103.67,38.35 ; 109.56,38.35 109.78,38.13 U20.1 109.78,34.53 C35.1 ; 103.67,38.35 103.94,38.09 U19.1 103.94,34.33 C33.1 ; 103.67,38.35 98.3,38.35 ; C77.1 92.29,36.27 U30.1 92.36,37.95 92.77,38.35 98.3,38.35 ; R21.2 90.05,18.34 P7.2 ; R1.1 75.48,28.05 U3.4 ; 98.3,38.35 U16.1 98.3,32.35 R8.2 ; 119.26,10.25 119.27,10.26 v1(120.27,10.26) ; 74.59,21.14 74.6,21.13 78.31,21.13 79.01,20.43 R96.2
  Top Layer w1: R28.2 R10.2 74.59,24.49 76.29,26.19 U3.4 ; 88.22,28.85 86.34,28.85 ; 88.22,28.85 90.2,30.84 90.2,36.26 C77.1 ; 88.22,28.85 88.37,28.85 93.01,24.22 93.01,22.76 ; R86.2 106.93,10.21 v1(107.98,10.21) ; R92.2 96.35,8.7 95.84,9.21 v1(95.84,10.26) 95.78,10.26 93.01,13.03 R21.2 93.01,22.76 ; R96.2 80.4,18.38 R94.2 ; 93.01,22.76 93.05,22.72 C24.2 ; v1(114.18,10.26) 113.12,10.26 113.11,10.25
  Bottom Layer w0.3: v1(114.99,30.23) 114.99,32.56 v1(115.3,32.87)
  Bottom Layer w1: v1(95.84,10.26) v1(114.18,10.26) v1(120.27,10.26)
5V: length 124.1
  Top Layer w1: P30.2 135.62,7.5 Q4.2 134.53,8.59 R102.2 ; D4.2 140.39,23.47 141.05,22.81 138.65,22.81 ; P16.1 143.64,22.81
  Bottom Layer w1: 135.21,22.91 135.21,12.51 138.97,8.75 138.97,4.22 138.16,3.4 135.62,3.4 ; 135.21,22.91 135.21,36.42 132.67,38.96 74.76,38.96 U4.6 ; 135.21,22.91 141,22.91 P16.1
12V: length 147.6
  Top Layer w0.3: R37.2 R38.2 R36.2 ; L1.2 47.02,51.92 NOREF#11.1 ; 45.95,53.85 46.08,53.72 NOREF#11.1 ; 44.93,53.85 36.41,53.85 R108.2 R109.2 ; 49.2,54.97 C12.2 ; NOREF#11.1 47.96,53.72
  Top Layer w2: C79.1 68.16,74.47 67.8,74.83 67.8,64.67 63.28,60.15 54.74,60.15 48.32,53.72 C11.1
  Bottom Layer w2: P15.2 18.01,3.55 27.18,12.72 45.92,12.72 52.81,19.61 52.81,49.81 49.84,52.78 NOREF#11.1
24V: length 238.8
  Top Layer w0.3: 86.29,68.12 86.08,68.12 85.33,67.37 85.33,66.92 ; U25.28 124.57,67.44 123.88,68.12 ; 114.33,68.02 113.49,67.18 113.49,66.92 ; 81.51,68.02 81.77,68.02 82.33,67.46 U21.28 ; 142.27,68.13 141.65,67.51 U23.22 ; R30.1 35.29,80.82 34.52,81.58 27.36,81.58 26.69,80.91 P17.2 ; 99.41,66.92 99.41,67.22 100.05,67.87 ; 35.65,14.17 v1(35.65,16.43) 35.65,17.57 U2.1 ; 35.65,14.17 35.03,14.17 v1(33.96,15.24) ; 35.65,14.17 35.65,12.45 ; 109.81,68.02 110.49,67.34 U24.28 ; 128.3,68.07 127.57,67.34 127.57,66.92 ; 137.7,67.97 138.24,67.97 138.65,67.56 U23.28 ; 95.43,68.02 95.74,68.02 96.41,67.35 U22.28
  Top Layer w1: 118.87,74.33 119.18,74.02 C45.1 121.13,73.98 C56.2 121.2,71.98 122.15,71.98 122.86,71.27 122.86,68.78 123.7,67.94 ; C40.1 102.3,70.12 100.05,67.87 ; 142.27,68.12 142.27,68.13 144.33,70.19 145.41,70.19 ; 109.81,68.02 108.79,69.04 108.79,71.2 108.08,71.92 C55.2 107.03,73.96 C43.1 105.06,74.02 104.85,74.23 ; 78.93,72.84 C52.2 79.7,71.92 80.55,71.07 80.55,68.99 81.51,68.02 ; 78.93,72.84 C37.1 ; 78.93,72.84 78.74,72.64 v1(75.32,72.64) ; 132.86,73.21 133.48,73.84 C41.1 135,73.71 C54.2 135.97,71.85 136.68,71.14 136.68,68.53 137.24,67.97 137.7,67.97 ; 90.86,74.06 90.9,74.02 C39.1 92.93,73.94 C53.2 93.77,71.92 94.57,71.12 94.57,68.89 95.43,68.02 ; C46.1 130.36,70.13 128.3,68.07 ; 114.33,68.02 116.38,70.07 C44.1 ; C38.1 88.22,70.06 86.29,68.12
  Top Layer w2: C44.1 118.87,73.2 118.87,79.2 ; v1(75.32,72.64) 75.32,76.25 78.26,79.2 90.86,79.2 ; 18.01,9.45 P31.2 30.36,9.5 30.72,9.86 C8.1 ; C40.1 102.41,70.72 104.85,73.15 104.85,79.2 ; 132.76,79.2 132.86,79.1 132.86,73.21 C46.1 ; 132.76,79.2 118.87,79.2 ; 132.76,79.2 139.82,79.2 144.12,74.89 144.12,70.85 ; 118.87,79.2 104.85,79.2 ; 104.85,79.2 90.86,79.2 ; 90.86,79.2 90.86,72.64 88.94,70.72 C38.1
  vias: v1(31.42,35.36) v1(31.58,37.24) v1(32.08,15.66) v1(33.4,35.19) v1(33.46,16.56) v1(74.1,71.48) v1(74.2,74.12) v1(76.45,74.12) v1(76.48,71.48)
48V_SPN-: length 44.4
  Top Layer w0.2: 14.03,47.8 13.98,47.75 13.98,44.25
  Top Layer w0.3: 29.19,51.61 27.82,52.98 23.75,52.98 23.75,52.63 21.71,50.59 14.03,50.59 ; D10.1 10.56,63.37 C71.2 14.03,52 14.03,50.59 ; 14.03,50.59 14.03,47.8 ; P2.2 v1(10.77,44.56) v1(12.25,44.56) 13.67,44.56 13.98,44.25
  vias: v1(8.3,47.02) v1(8.6,55.47) v1(8.6,53.35) v1(8.82,51.36) v1(8.91,42.06) v1(8.97,61.27) v1(8.97,58.49) v1(9.07,65.84) v1(10.23,65.84) v1(10.39,61.27) v1(10.55,52.07) v1(10.68,42.06) v1(10.77,47.04) v1(11,58.49) v1(11.49,65.84) v1(12.37,42.06) v1(12.63,47.04) v1(13.54,49.48) v1(13.98,51.6)
GND: length 350.2
  Top Layer w0.28: U23.18 NOREF#48.5 ; U24.18 113.11,64.42 NOREF#38.5 ; 89.36,54.86 87.64,54.86 87.36,55.14 R72.1 ; U25.18 127.19,64.42 NOREF#25.5 ; U22.3 96.33,64.92 NOREF#53.5 ; NOREF#37.5 124.49,64.92 U25.3 ; NOREF#16.5 99.03,64.42 U22.18
  Top Layer w0.3: U23.3 138.55,64.92 NOREF#36.5 ; U21.3 82.25,64.92 NOREF#33.5 ; v1(48.85,69.55) v1(50.07,69.55) 50.69,69.55 Q3.3 ; U21.18 84.95,64.42 NOREF#52.5 ; NOREF#26.5 110.41,64.92 U24.3
  Top Layer w0.5: v1(54.28,25.25) 54.28,26.16 51.08,22.96 v1(49.15,22.96) ; U1.5 28.68,45.61 U1.6 ; v1(102.18,54.26) 102.18,54.36 101.58,54.97 ; 25.17,12.29 16.08,12.29 v1(15.93,12.45) ; v1(49.15,21.28) 49.1,21.34 v1(40.47,21.34) U2.3 ; C13.2 39.91,31.9 v1(38.49,30.48) 38.42,30.55 C4.2 C6.1 ; R61.1 103.19,55.08 101.69,55.08 101.58,54.97 ; v1(102.56,45.06) C34.1 102.11,43.6 102.11,41.94 ; U30.5 96.17,43.45 96.71,43.99 96.66,44.04 v1(95.53,44.04) ; U1.3 41.38,42.22 v1(41.43,42.16) ; v1(49.05,19.51) 51.96,19.51 D3.1 53.4,18.95 56.57,18.95 56.57,12.6 54.69,10.72 37.98,10.72 37.05,11.64 C7.2 C9.1 37.05,14.62 v1(37.62,15.19) ; 101.58,54.97 101.58,55.17 R70.1 ; 107.75,41.94 107.75,43.7 C36.1 108.25,44.51 v1(109.05,45.31) ; 119.44,41.74 119.44,42.7 120.07,43.33 121.14,43.33 v1(121.14,42.57) ; v1(149.58,44.35) 148.11,45.82 v1(148.11,46.08) ; C5.2 24.92,30.99 v1(24.92,21.34) 28.32,24.74 U2.5 ; v1(114.53,43.03) 114.04,43.52 C32.1 113.59,43.7 U20.5 ; U4.2 61.7,35.58 62.2,35.08 62.2,33.06
  Top Layer w0.6: C44.2 116.08,76.02 C43.2 ; C40.2 102,76.02 C39.2 ; C37.2 83.44,76.02 R46.1 88.02,76.12 C38.2 ; R76.2 76.79,67.3 R78.2 ; C45.2 130.06,76.02 C46.2
  Top Layer w1: v1(149.58,44.35) 149.58,34.47 v1(149.38,34.26) ; v1(138.66,53.8) 138.99,53.8 139.19,54 C59.2 ; C78.1 v1(88.57,40.81) ; v1(147.76,64.06) 149.58,62.23 v1(149.58,59.33) v1(149.58,54.75) ; C57.2 83.43,53.68 v1(83.39,53.64) ; C58.2 97.51,53.55 v1(97.62,53.44) ; 145.04,55.24 R71.1 ; C61.2 125.67,54.43 v1(124.35,53.12) ; R78.2 v1(76.84,68.17)
  Bottom Layer w0.5: P6.2 51.85,2.03 52.2,1.68 ; P14.2 93.81,2.79 92.69,1.68 83.1,1.68 ; 52.2,1.68 62.52,1.68 ; 52.2,1.68 42.4,1.68 41.89,2.18 41.89,2.9 P4.2 ; 62.52,1.68 62.41,1.78 62.41,3.3 P8.2 ; 62.52,1.68 72.64,1.68 ; 52.96,68.73 50.88,68.73 v1(50.07,69.55) ; 72.64,1.68 83.1,1.68 ; 72.64,1.68 72.67,1.71 72.67,3.15 P10.2 ; 83.1,1.68 83.35,1.93 83.35,3.4 82.94,3.81 ; v1(95.53,44.04) 94.57,45 102.5,45 v1(102.56,45.06) 108.79,45.06 v1(109.05,45.31) 111.33,43.03 v1(114.53,43.03) 120.68,43.03 v1(121.14,42.57)
  Bottom Layer w1: v1(147.76,64.06) 141.61,64.06 NOREF#48.5 ; v1(88.57,40.81) 88.57,40.89
  vias: v1(2.42,16.31) v1(2.42,11.74) v1(2.69,25.61) v1(2.72,21.9) v1(3.66,27.88) v1(3.96,32.96) v1(11,1.02) v1(11.66,83.87) v1(12.68,10.52) v1(13.41,8.34) v1(13.64,3.15) v1(14.3,11.74) v1(15.02,83.82) v1(16.52,40.51) v1(16.69,38.1) v1(17.86,40.64) v1(18.58,48.06) v1(18.62,44.86) v1(18.93,16.81) v1(19.23,83.8) v1(19.33,21.79) v1(19.44,27.64) v1(19.38,25.4) v1(19.73,41.17) v1(19.69,1.68) v1(19.84,46.15) v1(19.82,42.94) v1(19.9,44.53) v1(21.67,1.63) v1(22.38,46.23) v1(22.43,44.4) v1(22.43,40.79) v1(22.43,39.01) v1(22.48,42.52) v1(22.94,27.74) v1(23.19,25.04) v1(23.24,23.22) v1(23.24,19.61) v1(23.24,17.83) v1(23.29,82.43) v1(23.32,81.65) v1(23.29,21.34) v1(24.01,46.23) v1(24.06,44.4) v1(24.12,42.52) v1(24.06,40.79) v1(24.06,39.01) v1(24.82,25.04) v1(24.87,48.06) v1(24.87,23.22) v1(24.87,19.61) v1(24.87,17.83) v1(26.04,46.33) v1(26.09,44.5) v1(26.14,42.62) v1(26.09,40.89) v1(26.09,39.12) v1(26.19,82.3) v1(26.68,84.75) v1(26.84,25.15) v1(26.89,23.32) v1(26.95,21.44) v1(26.89,19.71) v1(26.89,17.93) v1(27,27.79) v1(27.41,48.06) v1(27.82,1.63) v1(28.88,82.69) v1(30.87,84.75) v1(30.94,82.84) v1(32.8,82.7) v1(33.56,7.52) v1(34.02,6.15) v1(35.34,1.63) v1(35.78,81.82) v1(35.89,7.82) v1(36.45,81.38) v1(37.42,78.08) v1(37.42,76.45) v1(37.52,1.32) v1(38.23,45.62) v1(38.54,28.96) v1(38.59,25.15) v1(38.79,47.4) v1(39.04,76.45) v1(39.25,42.16) v1(40.87,34.09) v1(41.28,59.51) v1(41.69,22.4) v1(41.69,1.42) v1(42.15,58.48) v1(42.3,61.47) v1(42.3,21.08) v1(42.73,59.31) v1(43.31,41.66) v1(43.8,60.17) v1(44.57,62) v1(44.84,22.35) v1(44.78,21.23) v1(45.35,80.85) v1(46.65,60.5) v1(47.02,59.24) v1(46.97,21.18) v1(47.17,19.96) v1(47.27,1.52) v1(47.68,60.71) v1(48.95,18.19) v1(49.2,46.74) v1(49.15,45.26) v1(49.2,42.57) v1(49.41,61.06) v1(51.95,11.84) v1(51.95,1.52) v1(52.76,79.2) v1(54.08,79.15) v1(54.34,20.22) v1(54.59,21.9) v1(55.3,63.09) v1(55.25,56.79) v1(56.32,1.57) v1(57.64,7.77) v1(58.25,1.57) v1(58.5,81.43) v1(58.94,7.77) v1(59.01,8.99) v1(59.26,22) v1(59.26,20.91) v1(59.47,63.81) v1(59.76,47.07) v1(60.18,46.12) v1(60.57,47.81) v1(61.25,75) v1(61.64,72.59) v1(61.76,78.72) v1(62.24,64.91) v1(62.41,58.32) v1(62.5,72.65) v1(62.46,24.38) v1(63.22,64.67) v1(63.64,21.45) v1(63.78,79.75) v1(63.79,15.91) v1(63.88,72.19) v1(64.12,71.31) v1(64.34,79.05) v1(64.37,18.65) v1(64.45,10.33) v1(64.6,13.12) v1(64.65,76.5) v1(64.95,7.52) v1(65.07,24.38) v1(66.58,1.63) v1(68.54,59.78) v1(68.81,61.21) v1(70.79,79.2) v1(71.5,76.92) v1(73.01,55.57) v1(73.39,79.2) v1(74.86,85.26) v1(77.55,82.45) v1(79.15,43.76) v1(79.23,77.47) v1(79.85,43.41) v1(80.45,84.78) v1(80.66,43.34) v1(81.16,77.47) v1(81.92,43.51) v1(82.77,43.45) v1(83.44,1.63) v1(87.91,54.25) v1(88.97,56.03) v1(89.18,65.84) v1(89.3,76.82) v1(89.3,75.81) v1(89.3,74.6) v1(89.3,73.52) v1(89.3,40.81) v1(90.15,56.03) v1(90.35,63.65) v1(90.81,65.48) v1(91.72,66.9) v1(91.67,58.67) v1(91.88,68.94) v1(92.28,56.49) v1(92.64,84.89) v1(93.2,76.96) v1(93.86,1.52) v1(95.13,77.01) v1(95.18,52.63) v1(95.74,53.61) v1(96.38,53.19) v1(96.57,54) v1(97.57,6.35) v1(97.57,5) v1(97.72,2.03) v1(98.63,0.6) v1(103.2,73.97) v1(103.26,77.06) v1(103.26,76.1) v1(103.26,75.03) v1(103.92,64.87) v1(104.07,67.06) v1(104.37,56.64) v1(105.39,69.9) v1(106.56,0.6) v1(107.09,75.02) v1(107.42,76.91) v1(108.08,85.04) v1(109.05,0.6) v1(109.61,53.75) v1(110.63,53.67) v1(111.14,54.26) v1(111.64,53.75) v1(114.63,0.6) v1(115.14,77.22) v1(115.14,75.44) v1(115.15,84.87) v1(115.19,73.81) v1(116.46,73.86) v1(116.87,66.04) v1(117.07,66.95) v1(117.79,56.58) v1(118.34,65.33) v1(118.55,68.68) v1(118.68,56.54) v1(118.95,66.75) v1(119.42,56.97) v1(119.61,70.97) v1(119.87,84.89) v1(120.17,0.6) v1(120.73,77.42) v1(120.78,75.13) v1(122.76,0.61) v1(122.96,53.8) v1(123.3,85.14) v1(123.5,53.15) v1(123.79,53.84) v1(128.5,85.14) v1(129.11,77.22) v1(129.11,75.44) v1(129.16,73.81) v1(130.28,0.6) v1(130.43,73.86) v1(130.54,55.21) v1(131.04,84.73) v1(131.28,56.8) v1(131.6,67.87) v1(131.7,65.18) v1(132.26,56.79) v1(132.77,64.01) v1(133.23,70.56) v1(133.23,68.42) v1(133.38,66.85) v1(135.13,74.84) v1(135.16,77.32) v1(135.41,53.12) v1(137.76,53.81) v1(138.08,52.97) v1(141.39,0.68) v1(145.39,66.63) v1(145.83,56.74) v1(146.71,65.73) v1(147.88,65.41) v1(148.47,61.47) v1(148.47,57.1) v1(148.47,52.88) v1(148.94,64.94) v1(150.06,71.88) v1(150.5,64.47) v1(150.5,31.41) v1(150.57,68.46) v1(150.57,67.44) v1(150.6,40.74) v1(150.55,37.29) v1(150.55,34.86) v1(150.6,14.17) v1(150.7,23.51) v1(150.65,20.05) v1(150.65,17.63) v1(150.97,62.71) v1(151.02,60.66) v1(151.24,71.72)
PGND: length 434.7
  Top Layer w0.2: USB1.5 144.61,30.32 R12.1 ; U29.2 135.97,29.92 135.51,29.46 133.56,29.46 132.07,30.96 ; 137.49,36.98 140,36.98 USB1.4
  Top Layer w0.3: R16.1 96.37,29.29 v1(95.99,29.67) ; v1(91.72,29.57) 91.72,27.74 95.34,24.12 C24.1 97.48,24.12 98.5,23.1 U6.35 102.73,23.1 ; 108.04,34.19 108.04,33.54 v1(107.88,33.38) ; v1(85.22,19.3) 84.31,20.22 C69.1 ; v1(85.22,19.3) 84.31,18.39 C68.1 ; v1(85.22,19.3) 86.64,20.73 86.64,22.86 85.12,24.38 v1(78.67,24.38) ; U30.4 v1(97.01,36.34) ; v1(117.99,29.11) 116.73,29.11 116.72,29.1 ; v1(109.5,29.72) 109.4,29.72 106.46,26.77 v1(105.85,26.77) 105.63,26.77 104.23,28.17 U6.20 ; v1(111.89,6.6) 110.15,6.6 109.69,7.06 C65.1 ; 102.73,23.1 102.75,23.11 v1(102.9,23.11) 104.68,23.11 106.2,24.64 107.27,24.64 107.57,24.94 v1(107.57,26.57) ; 102.73,23.1 101.07,21.44 v1(98.18,21.44) ; C33.2 102.44,34.23 v1(102.44,33.27) ; v1(88.7,31.67) 88.79,31.75 C77.2 ; v1(94.62,30.38) 100.05,30.38 102.39,28.04 102.39,27.95 ; C66.1 115.79,6.44 v1(115.75,6.4) ; v1(102.85,36.42) 102.45,36.42 102.42,36.39 102.11,36.39 ; C31.2 v1(113.88,32.82) ; U4.4 66.78,36 69.08,33.7 69.08,31.56 68.41,30.89 68.41,28.8 69.17,28.04 D1.2 ; C26.1 113.06,26.87 v1(112.78,26.59) 112.29,26.1 U6.8 ; v1(102.09,6.5) 101.29,7.3 C67.1 103.39,8.43 C64.1 103.45,8.29 v1(105.85,5.89) 106.76,5.89 ; P7.1 89.84,11.99 K1.1 ; 129.31,28.2 C20.2 ; 129.31,28.2 132.07,30.96 ; 129.31,28.2 C21.2 ; C23.2 123.6,23.78 C22.2 ; v1(108.08,18.29) 108.08,19.05 107.23,19.9 U6.47 107.23,22.35 107.98,22.35 109.61,20.73 112.86,20.73 ; v1(122.41,7.01) 122.51,7.11 R100.2 124.26,8.65 Q5.3 ; v1(102.39,27.38) 102.39,27.95 ; 102.39,27.95 102.73,28.29 U6.23
  Top Layer w0.5: 71.12,8.89 v1(68.1,8.89) ; C33.2 102.11,34.58 102.11,36.39 ; C31.2 113.59,34.38 U20.4 ; U8.1 135.54,18.85 136.73,18.85 137.23,19.34 C18.2 ; v1(67.7,14.63) 71.02,14.63 71.18,14.48 ; 107.75,36.39 107.75,34.48 108.04,34.19 ; C25.1 109.7,15.3 R2.1 ; 96.71,34.14 96.17,34.68 U30.4 ; v1(68.05,20.27) 68.2,20.12 U7.3 72.22,20.12 v1(72.72,20.62)
  Top Layer w0.6: 109.45,3.4 109.25,3.4 106.76,5.89 106.56,6.1 ; v1(111.89,6.6) 115.19,3.3 117.23,3.3
  Top Layer w1: C18.2 137.94,20.27 P16.3 143.64,20.27 ; Q6.2 139.19,5.18 139.39,5.38 ; R2.1 107.88,13.82 v1(108.54,13.16) ; 23.3,3.4 23.3,5.64 24.16,6.5 30.12,6.5 31.12,5.5 31.12,3.4 ; K1.2 K1.1 ; 67,42.07 U4.4
  Bottom Layer w0.3: v1(102.9,23.11) 103.26,23.11 v1(108.08,18.29) ; v1(108.08,18.29) 114.89,18.29 v1(115.55,17.63) 115.9,17.27 v1(115.9,15.54) ; v1(108.08,18.29) 108.08,17.63 107.47,17.02 106.25,17.02 103.97,14.74 v1(102.11,14.74) ; v1(108.13,32.16) 109.5,30.78 v1(109.5,29.72) ; 91.7,29.67 90.7,29.67 v1(88.7,31.67) ; 91.7,29.67 91.7,29.59 v1(91.72,29.57) ; 91.7,29.67 v1(95.99,29.67) ; v1(108.54,13.16) 109.35,12.34 v1(112.55,12.34) v1(114.51,12.34) 116.72,12.34 v1(117.17,11.89) v1(118.81,11.89) 121.02,11.89 122.41,10.5 v1(122.41,7.01) 121.95,6.55 108.54,6.55 107.93,5.94 105.9,5.94 v1(105.85,5.89) 105.24,6.5 v1(102.09,6.5) ; P7.1 89.44,15.19 84.66,15.19 84.15,15.7 84.15,18.24 v1(85.22,19.3) ; v1(102.85,36.42) 97.09,36.42 v1(97.01,36.34) ; v1(118.88,34.27) 117.99,33.37 v1(117.99,29.11) 115.4,26.52 112.78,26.52 v1(112.78,26.59) 113.88,27.7 v1(113.88,32.82) 113.33,33.38 v1(111.42,33.38) v1(107.88,33.38) 107.78,33.27 v1(102.44,33.27) 102.44,27.43 v1(102.39,27.38) 105.24,27.38 v1(105.85,26.77)
  Bottom Layer w1: v1(78.67,24.38) 75.57,24.38 72.22,27.74 v1(67.25,27.74) 59.62,27.74 55.91,24.03 55.91,13 53.32,10.41 28.38,10.41 23.25,5.28 23.25,3.45 23.3,3.4
  vias: v1(65.51,40.7) v1(65.51,38.05) v1(67.04,24.28) v1(67.25,31.75) v1(67.75,17.78) v1(67.8,12.14) v1(71.51,13) v1(75.57,42.42) v1(76.53,15.34) v1(76.53,13.03) v1(76.53,9.55) v1(77.45,23.27) v1(77.91,40.54) v1(79.83,36.35) v1(80.33,35.81) v1(80.55,32.97) v1(80.85,25.45) v1(82.29,33.92) v1(84.15,31.4) v1(87.36,24.08) v1(87.66,18.75) v1(88.14,34.92) v1(88.93,8.38) v1(90.56,10.67) v1(91.01,13.11) v1(91.85,30.96) v1(92.03,33.58) v1(92.94,10.57) v1(94.57,25.25) v1(94.98,14.88) v1(95.33,19.61) v1(96.19,13.11) v1(98.48,14.38) v1(99.24,6.71) v1(99.29,4.26) v1(99.29,2.18) v1(106.25,2.39) v1(111.79,18.19) v1(113.81,18.06) v1(114.08,2.44) v1(114.8,4.05) v1(121.9,2.18) v1(122.67,4.51) v1(123.52,20.32) v1(124.64,19.15) v1(124.95,22.76) v1(125,6.71) v1(128.97,26.07) v1(128.97,24.42) v1(129.72,5.13) v1(130.08,40.79) v1(131.14,29.67) v1(131.35,42.62) v1(131.62,5.79) v1(132.31,43.64) v1(133.33,44.7) v1(133.79,30.23) v1(133.79,27.58) v1(133.89,5.79) v1(135.01,43.43) v1(135.82,44.65) v1(137.19,6.1) v1(137.24,4.88) v1(137.75,43.54) v1(138.71,44.7) v1(139.63,40.84) v1(143.43,44.7) v1(146.08,44.55) v1(146.08,42.7) v1(146.08,39.42) v1(146.08,36.63) v1(146.08,33.7) v1(146.08,31.39)
VCC: length 411.2
  Top Layer w0.28: 128.57,62.92 128.57,59.32 v1(129.06,58.83) ; 100.31,58.57 100.31,62.81 100.41,62.92 ; U23.15 142.65,59.41 v1(143.64,58.42)
  Top Layer w0.3: v1(86.95,58.67) 87.25,58.98 87.25,62.38 86.72,62.92 86.33,62.92 ; v1(57.46,64.72) 56.95,65.23 R35.2 ; R6.2 90.08,42.68 C78.2 ; U13.5 58.5,69.53 58.5,66.45 58.16,66.11 U15.5 ; 114.49,62.92 114.49,59.73 114.94,59.28 v1(114.94,58.32)
  Top Layer w0.5: C78.2 90.54,43.68 v1(90.53,43.69) 91.41,43.69 92.36,42.75 U30.8 92.36,40.46 92.84,39.98 98.18,39.93 ; R67.1 99.53,53.99 v1(99.51,53.98) ; v1(113.52,53.8) 113.53,53.8 ; 113.53,53.8 R68.1 ; 113.53,53.8 116.88,53.8 R58.2 ; R65.1 141.23,54.11 ; C36.2 109.78,44.06 U20.8 109.78,40 109.71,39.93 ; 98.18,39.93 98.3,40.05 98.3,43.8 C30.2 ; 98.18,39.93 103.89,39.93 ; C32.2 115.63,43.96 115.63,40.41 115.14,39.93 109.71,39.93 ; 103.96,44.04 103.96,42.06 ; L3.2 41.35,24.89 39.5,23.04 U2.4 ; L2.2 48.19,30.03 C13.1 58.18,31.9 58.99,32.72 58.99,41.69 U4.1 ; 103.94,41.94 103.94,39.98 103.89,39.93 ; 103.89,39.93 109.71,39.93 ; 127.63,53.7 R69.1
  Top Layer w0.6: 127.53,51.58 127.59,51.64 v1(127.59,53.7) ; 144.4,51.58 144.4,52.51 145.13,53.24 ; 141.16,51.58 141.15,51.59 v1(141.15,54.05) ; 117.47,51.58 117.54,51.65 R58.2 ; R66.1 85.48,55.17 v1(85.48,53.85) 85.48,51.58 ; R59.2 131.51,51.84 131.25,51.58 ; R55.2 89.4,51.58 ; 72.35,51.58 72.3,51.63 R75.1 ; R56.2 103.56,53.1 103.56,51.58 ; 99.51,51.58 v1(99.51,53.98)
  Top Layer w1: 58.99,32.72 58.99,29.33 60.59,27.73 60.59,5.99 ; 54.69,5.99 46.6,5.99 P4.3 ; 54.69,5.99 54.39,5.68 P6.3 ; 54.69,5.99 60.59,5.99 ; 85.48,51.58 90.65,51.58 ; 85.48,51.58 77.06,51.58 ; 85.48,51.58 85.48,51.57 J3.3 ; 77.06,51.58 57.43,51.58 v1(57.43,50.42) 57.43,43.59 U4.1 ; 77.06,51.58 76.96,51.48 P3.1 ; 132.2,51.58 127.17,51.58 ; 132.2,51.58 132.25,51.53 J1.1 ; 132.2,51.58 141.16,51.58 ; P8.3 64.95,3.4 64.95,5.81 64.77,5.99 ; J2.3 141.06,51.49 141.16,51.58 ; 99.51,51.58 104.42,51.58 ; 99.51,51.58 90.65,51.58 ; 99.51,51.58 99.38,51.45 J4.3 ; J3.1 90.65,49.68 90.65,51.58 ; 141.16,51.58 144.4,51.58 146.14,49.84 J2.1 ; 75.21,5.99 85.61,5.99 ; 75.21,5.99 75.42,5.78 P10.3 ; 75.21,5.99 64.77,5.99 ; 85.61,5.99 95.18,5.99 96.3,4.87 96.3,3.25 ; 85.61,5.99 85.83,5.76 85.83,3.45 85.88,3.4 ; U15.5 v1(57.46,64.72) ; 64.77,5.99 60.59,5.99 ; 113.3,51.58 113.27,51.55 J5.3 ; 113.3,51.58 118.42,51.58 ; 113.3,51.58 104.42,51.58 ; 118.42,51.58 118.35,51.52 J5.1 ; 118.42,51.58 127.17,51.58 ; J4.1 104.46,51.55 104.42,51.58 ; 127.17,51.58 127.17,51.58 J1.3
  Bottom Layer w0.28: v1(127.59,53.7) 129.06,55.17 v1(129.06,58.83) ; v1(141.15,54.05) 143.64,56.54 v1(143.64,58.42) ; v1(99.51,53.98) 99.51,57.58 100.31,58.38 v1(100.31,58.57)
  Bottom Layer w0.3: v1(113.52,53.8) 114.94,55.22 v1(114.94,58.32)
  Bottom Layer w0.5: v1(85.48,53.85) 85.48,56.9 86.95,58.37 v1(86.95,58.67)
  Bottom Layer w0.6: J3.3 85.48,48.74 v1(90.53,43.69)
  Bottom Layer w1: v1(57.46,64.72) 57.43,64.74 v1(57.43,51.78) v1(57.43,50.42)
BOOT0: length 5.8
  Top Layer w0.3: R2.2 106.57,16.9 105.73,17.74 U6.44
COOL: length 50.2
  Top Layer w0.3: R97.1 139.23,7.37 v1(137.9,7.37) ; v1(104.63,25.35) 104.37,25.6 104.37,27.3 103.73,27.94 U6.21
  Bottom Layer w0.3: v1(104.63,25.35) 104.63,24.64 108.79,20.47 118.85,20.47 119.51,19.81 119.51,14.88 127.03,7.37 v1(137.9,7.37)
EXIO: length 27
  Top Layer w0.3: U6.46 106.73,19.63 107.17,19.19 v1(107.17,18.14) ; R93.1 84.09,16.66 v1(85.37,16.66)
  Bottom Layer w0.3: v1(107.17,18.14) 106.18,18.14 104.66,16.61 85.42,16.61 v1(85.37,16.66)
HOLD: length 13.8
  Top Layer w0.3: R87.1 108.86,11.02 108.43,11.02 103.23,16.22 U6.39
MA_1A: length 18.1
  Top Layer w0.3: U23.24 140.65,68.32 v2(140.44,68.53)
  Bottom Layer w0.8: P25.3 136.33,79.47 137.84,77.95 137.84,69.28 138.84,68.28 140.19,68.28 v2(140.44,68.53)
MA_1B: length 29.2
  Top Layer w0.3: v2(143.49,66.6) 143.49,66.24 143.16,65.92 U23.21
  Bottom Layer w0.8: v2(143.49,66.6) 142.88,67.21 142.88,83.18 141.88,84.18 135.06,84.18 133.94,83.06 133.94,82.04 P25.4
MA_2A: length 15.3
  Top Layer w0.3: U23.26 139.65,69.58 v2(139.43,69.8)
  Bottom Layer w0.8: P25.2 139.43,81.33 v2(139.43,69.8)
MA_2B: length 21
  Top Layer w0.3: U23.1 137.06,65.92 136.73,66.24 v2(136.73,66.65)
  Bottom Layer w0.8: P25.1 141.62,81.68 141.62,67.77 140.65,66.8 136.88,66.8 v2(136.73,66.65)
MA_DIR: length 14.9
  Top Layer w0.3: 116.89,36.19 116.92,36.19 116.92,32.21 116.26,31.55 112.09,31.55 110.88,30.34 110.88,28 110.48,27.6 U6.11
MA_DIR_O: length 48.1
  Top Layer w0.28: v1(145.88,59.79) 145.88,62.48 143.44,64.92 U23.19
  Top Layer w0.5: 116.89,41.74 116.89,42.75 119.21,45.06 128.36,45.06 130.2,46.91 135.84,46.91 J2.4
  Bottom Layer w0.28: J2.4 138.52,49.84 139.93,51.25 139.93,58.06 141.66,59.79 v1(145.88,59.79)
MA_STEP: length 16.4
  Top Layer w0.3: 118.17,36.19 118.17,32.13 117.02,30.99 112.5,30.99 111.36,29.85 111.36,27.51 110.95,27.1 U6.10
MA_STEP_O: length 44.6
  Top Layer w0.28: v1(144.3,57.86) 144.3,62.64 143.52,63.42 U23.16
  Top Layer w0.5: J2.2 140.19,46.18 130.94,46.18 129.01,44.25 119.61,44.25 118.17,42.8 118.17,41.74
  Bottom Layer w0.28: v1(144.3,57.86) 144.3,51.57 143.6,50.87 J2.2
MOTOR_EN: length 125.3
  Top Layer w0.28: v1(120.43,62.08) 120.43,63.38 122.46,65.42 U25.2 ; U24.2 108.22,65.42 106,63.2 v1(106,62.08) ; U22.2 95.39,65.43 93.76,65.43 92.38,64.06 v1(92.38,62.13)
  Top Layer w0.3: v1(78.87,64.11) 80.18,65.42 U21.2 ; U23.2 136.41,65.42 134.6,63.6 v1(134.6,62.08)
  Top Layer w0.4: v1(93.44,55.25) 93.44,60.06 92.38,61.12 v1(92.38,62.13) ; v1(93.45,44.25) 93.16,44.53 77.35,44.53 74.42,47.46 P3.2
  Top Layer w0.5: U30.6 94.9,42.8 v1(93.45,44.25)
  Bottom Layer w0.28: 92.13,62.08 92.18,62.13 v1(92.38,62.13)
  Bottom Layer w0.3: v1(78.87,64.11) 79.79,64.11 81.82,62.08 v1(106,62.08) v1(120.43,62.08) v1(134.6,62.08)
  Bottom Layer w0.4: v1(93.45,44.25) 93.45,55.25 v1(93.44,55.25)
MOTOR_EN_C: length 17.8
  Top Layer w0.3: v1(95.38,32.31) 95.48,32.21 R8.1 ; U6.18 105.23,30.99 104.53,31.69 100.47,31.69 v1(99.85,32.31)
  Top Layer w0.5: U30.3 94.9,33.87 R8.1
  Bottom Layer w0.3: v1(99.85,32.31) v1(95.38,32.31)
MS1: length 87.1
  Top Layer w0.28: U25.9 125.07,60.98 v1(124.69,60.6) ; v1(82.28,60.71) 82.83,61.26 U21.9 ; v1(96.3,60.4) 96.91,61.01 U22.9
  Top Layer w0.3: U24.9 110.99,61.07 v1(110.62,60.71) ; P28.1 75.36,58.88 75.36,63.37 73.03,65.7 ; v1(137.9,60.45) 137.9,60.55 138.46,60.55 139.15,61.24 U23.9
  Bottom Layer w0.28: 126.36,61.37 126.17,61.37 125.4,60.6 v1(124.69,60.6)
  Bottom Layer w0.3: v1(124.69,60.6) 124.29,60.6 123.52,61.37 111.94,61.37 111.28,60.71 v1(110.62,60.71) 110.11,60.71 109.45,61.37 98.63,61.37 97.67,60.4 v1(96.3,60.4) 95.64,60.4 94.62,61.42 82.99,61.42 v1(82.28,60.71) 78.11,60.71 77.65,61.16 76.31,61.16 75.82,60.67 75.82,58.42 P28.1 ; 126.36,61.37 136.99,61.37 v1(137.9,60.45)
MS2: length 83.5
  Top Layer w0.28: U25.10 125.57,60.31 v1(125.1,59.84) ; v1(82.78,60.05) 83.33,60.59 U21.10 ; v1(96.7,59.64) 97.41,60.35 U22.10
  Top Layer w0.3: v1(111.08,59.94) 111.49,60.35 U24.10 ; v1(138.82,59.44) 138.82,59.64 139.65,60.47 U23.10 ; R77.1 75.84,64.77 75.84,60.95 P28.3
  Bottom Layer w0.3: v1(138.82,59.44) 137.7,59.44 136.45,60.69 126.45,60.69 125.61,59.84 v1(125.1,59.84) 124.29,59.84 123.44,60.69 112.43,60.69 111.69,59.94 v1(111.08,59.94) 109.91,59.94 109.17,60.69 98.95,60.69 97.95,59.69 95.38,59.69 94.18,60.89 83.63,60.89 v1(82.78,60.05) 76.99,60.05 P28.3
